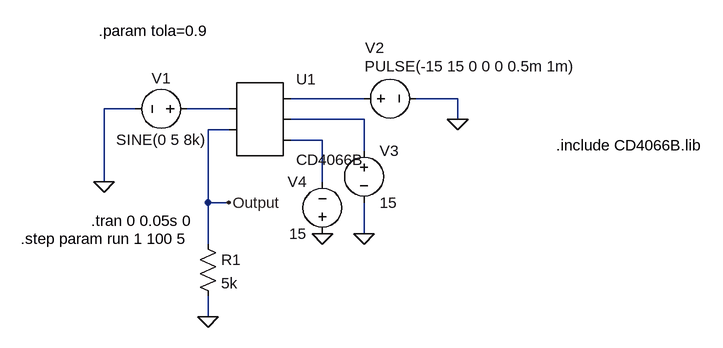
[diagram p0: schematic AnalogSwitch.asc]
AnalogSwitch.asc, the LTspice schematic file:
Version 4
SHEET 1 880 680
WIRE 32 -64 -80 -64
WIRE 176 -64 112 -64
WIRE -320 -48 -368 -48
WIRE -176 -48 -240 -48
WIRE 32 -32 -80 -32
WIRE 176 -32 176 -64
WIRE -176 -16 -208 -16
WIRE -32 0 -80 0
WIRE 32 16 32 -32
WIRE -368 64 -368 -48
WIRE -32 64 -32 0
WIRE -208 96 -208 -16
WIRE -176 96 -208 96
WIRE 32 144 32 96
WIRE -208 160 -208 96
WIRE -208 272 -208 240
FLAG -208 272 0
FLAG -176 96 Output
FLAG -368 64 0
FLAG 176 -32 0
FLAG 32 144 0
FLAG -32 144 0
SYMBOL voltage -224 -48 R90
WINDOW 0 -32 56 VBottom 2
WINDOW 3 32 56 VTop 2
WINDOW 123 0 0 Left 0
WINDOW 39 0 0 Left 0
SYMATTR InstName V1
SYMATTR Value SINE(0 5 8k)
SYMBOL voltage 16 -64 R270
WINDOW 0 78 18 VRight 2
WINDOW 3 50 17 VRight 2
WINDOW 123 0 0 Left 0
WINDOW 39 0 0 Left 0
SYMATTR InstName V2
SYMATTR Value PULSE(-15 15 0 0 0 0.5m 1m)
SYMBOL AutoGenerated\\CD4066B -128 -32 R0
SYMATTR InstName U1
SYMBOL res -224 144 R0
SYMATTR InstName R1
SYMATTR Value 5k
SYMBOL voltage 32 0 R0
WINDOW 123 0 0 Left 0
WINDOW 39 0 0 Left 0
SYMATTR InstName V3
SYMATTR Value 15
SYMBOL voltage -32 160 R180
WINDOW 0 24 96 Left 2
WINDOW 3 24 16 Left 2
WINDOW 123 0 0 Left 0
WINDOW 39 0 0 Left 0
SYMATTR InstName V4
SYMATTR Value 15
TEXT 328 8 Left 2 !.include CD4066B.lib
TEXT -388 124 Left 2 !.tran 0 0.05s 0
TEXT -376 -168 Left 2 !.param tola=0.9
TEXT -496 152 Left 2 !.step param run 1 100 5

The netlist it stands for:
* AnalogSwitch.asc
V1 N002 0 SINE(0 5 8k)
V2 N001 0 PULSE(-15 15 0 0 0 0.5m 1m)
* U1: CD4066B (symbol AutoGenerated\CD4066B not available, pins judged from their places): pin1=N002 pin2=Output pin3=N001 pin4=N003 pin5=N004
R1 Output 0 5k
V3 N003 0 15
V4 0 N004 15
.include CD4066B.lib
.tran 0 0.05s 0
.param tola=0.9
.step param run 1 100 5
.backanno
.end